# EAGLE design ProximitySensor (EAGLE 7.6.0)
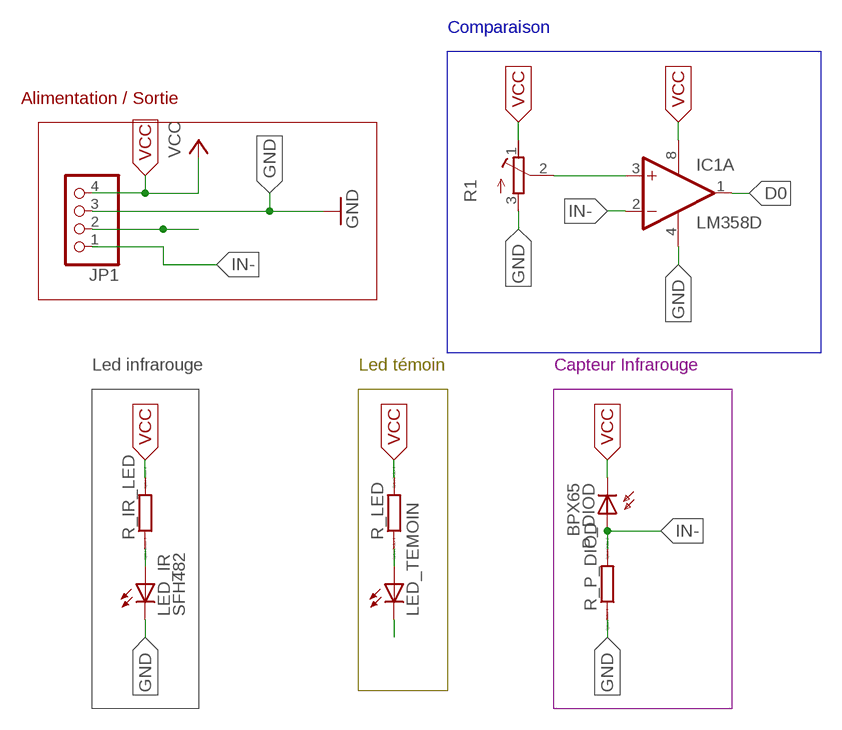
[diagram p0: schematic, sheet 1]

## Parts
IC1  LM358D  [SO08]
JP1  PINHD-1X4M  [1X04M]
LED_IR  SFH482  [SFH482]
LED_TEMOIN  LEDSMT1206  [1206]
P_DIOD  BPX65  [BPX65]
R1  R-TRIMMT93YA  [RTRIMT93YA]
R_IR_LED  RR1206  [R1206]
R_LED  RR1206  [R1206]
R_P_DIOD  RR1206  [R1206]

## Nets
D0: IC1.1(A:OUT) JP1.2 LED_TEMOIN.C
GND: IC1.4(P:V-) JP1.3 LED_IR.K(C) R1.3(A) R_P_DIOD.1
IN-: IC1.2(A:-IN) JP1.1 P_DIOD.A R_P_DIOD.2
N$1: LED_IR.A R_IR_LED.1
N$2: IC1.3(A:+IN) R1.2(S)
N$4: LED_TEMOIN.A R_LED.1
VCC: IC1.8(P:V+) JP1.4 P_DIOD.K(C) R1.1(E) R_IR_LED.2 R_LED.2
Unconnected: IC1.5(B:+IN) IC1.6(B:-IN) IC1.7(B:OUT)

## Buses
GND

## Notes on the sheet
- Comparaison
- Alimentation / Sortie
- Led infrarouge | Led témoin | Capteur Infrarouge

## Library data of the parts
IC1 = linear:LM358: OP AMP also LM158; LM258; LM2904 Source: http://cache.national.com/ds/LM/LM158.pdf
JP1 = pinhead:PINHD-1X4: PIN HEADER
LED_IR = led:SFH482: IR LED infrared emitting diode, Infineon
LED_TEMOIN = led:LED: LED OSRAM: - CHIPLED LG R971, LG N971, LY N971, LG Q971, LY Q971, LO R971, LY R971 LH N974, LH R974 LS Q976, LO Q976, LY Q976 LO Q996 - Hyper CHIPLED LW Q18S LB Q993, LB Q99A, LB R99A - SideLED LS A670, LO A670, LY A670, LG A670, LP A670 LB A673, LV A673, LT A673, LW A673 LH A674 LY A675 LS A676, LA A676, LO A676, LY A676, LW A676 LS A679, LY A679, LG A679 - Hyper Micro SIDELED® LS Y876, LA Y876, LO Y876, LY Y876 LT Y87S - SmartLED LW L88C, LW L88S LB L89C, LB L89S, LG L890 LS L89K, LO L89K, LY L89K LS L896, LA L896, LO L896, LY L896 - TOPLED LS T670, LO T670, LY T670, LG T670, LP T670 LSG T670, LSP T670, LSY T670, LOP T670, LYG T670 LG T671, LOG T671, LSG T671 LB T673, LV T673, LT T673, LW T673 LH T674 LS T676, LA T676, LO T676, LY T676, LB T676, LH T676, LSB T676, LW T676 LB T67C, LV T67C, LT T67C, LS T67K, LO T67K, LY T67K, LW E67C LS E67B, LA E67B, LO E67B, LY E67B, LB E67C, LV E67C, LT E67C LW T67C LS T679, LY T679, LG T679 LS T770, LO T770, LY T770, LG T770, LP T770 LB T773, LV T773, LT T773, LW T773 LH T774 LS E675, LA E675, LY E675, LS T675 LS T776, LA T776, LO T776, LY T776, LB T776 LHGB T686 LT T68C, LB T68C - Hyper Mini TOPLED® LB M676 - Mini TOPLED Santana® LG M470 LS M47K, LO M47K, LY M47K Source: http://www.osram.convergy.de LUXEON: - LUMILED® LXK2-PW12-R00, LXK2-PW12-S00, LXK2-PW14-U00, LXK2-PW14-V00 LXK2-PM12-R00, LXK2-PM12-S00, LXK2-PM14-U00 LXK2-PE12-Q00, LXK2-PE12-R00, LXK2-PE12-S00, LXK2-PE14-T00, LXK2-PE14-U00 LXK2-PB12-K00, LXK2-PB12-L00, LXK2-PB12-M00, LXK2-PB14-N00, LXK2-PB14-P00, LXK2-PB14-Q00 LXK2-PR12-L00, LXK2-PR12-M00, LXK2-PR14-Q00, LXK2-PR14-R00 LXK2-PD12-Q00, LXK2-PD12-R00, LXK2-PD12-S00 LXK2-PH12-R00, LXK2-PH12-S00 LXK2-PL12-P00, LXK2-PL12-Q00, LXK2-PL12-R00 Source: www.luxeon.com KINGBRIGHT: KA-3528ASYC Source: www.kingbright.com
P_DIOD = opto-trans-siemens:BPX65: PHOTO DIODE; MPN: BPX65.; OC_FARNELL: 327451; OC_NEWARK: 06WX2764
R1 = rcl:R-TRIMM: Trimm resistor
R_IR_LED R_LED R_P_DIOD = eagle-ltspice:R: RESISTOR, European symbol; SPICEMODEL: NONE; SPICEPREFIX: R

## Board
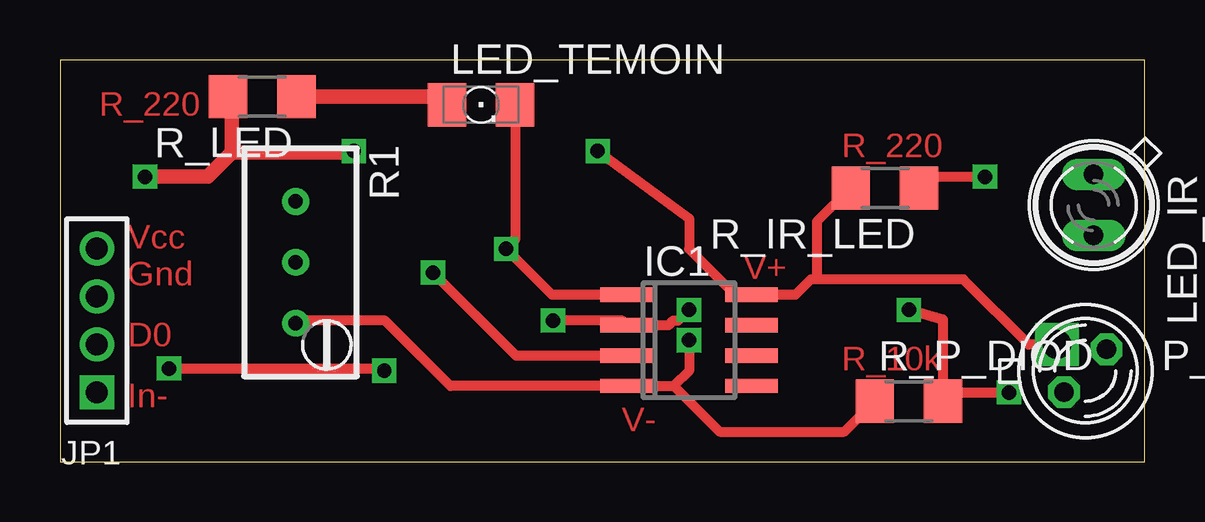
[diagram p1: board, top side]
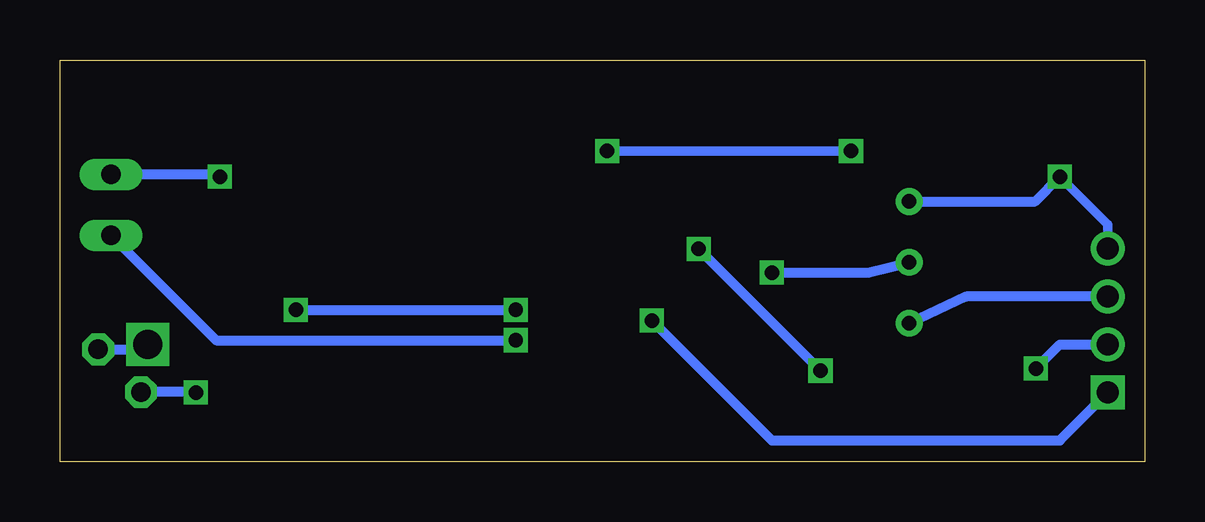
[diagram p2: board, bottom side, seen from below]

Size 45.2 x 16.77 mm. Coordinates in mm from the lower left corner, seen from the top.
Outline: 0,0 45.2,0 45.2,16.77 0,16.77 0,0
Copper layers (1*16): Top 0.035mm / dielectric 1.5mm / Bottom 0.035mm
Design rules "default": minimum track width 10mil, minimum drill 24mil, track to track 8mil, track to pad 8mil, pad to pad 8mil, via to via 8mil, smd to smd 8mil, copper to edge 40mil, drill to drill 8mil, minimum pad ring 10mil, minimum via ring 8mil, stop-mask expansion 4mil, vias tented up to drill 0mil, thermal gap 10mil

### Footprints (pad centres in the part's own frame; a part is rotated, then mirrored left to right if it is on the bottom)
SO08 = smd 0.6 x 2.2: 1 -1.905,-2.6; 2 -0.635,-2.6; 3 0.635,-2.6; 4 1.905,-2.6; 5 1.905,2.6; 6 0.635,2.6; 7 -0.635,2.6; 8 -1.905,2.6
1X04M = drill 0.914 square: 1 -3,0 | drill 0.914: 2 -1,0; 3 1,0; 4 3,0
SFH482 = drill 0.813 long: A -1.27,0; K 1.27,0
1206 = smd 1.6 x 1.803: A -1.422,0; C 1.422,0
BPX65 = drill 0.813 octagon: A -0.889,-0.889; K 0.889,0.889
RTRIMT93YA = drill 0.61: 1 0,-2.54; 2 0,0; 3 0,2.54
R1206 = smd 1.6 x 1.803: 1 -1.422,0; 2 1.422,0

### Placement (x,y rotation side)
IC1  26.21,5.08 270 top
JP1  1.54,5.9 90 top
LED_IR  43.07,10.72 270 top
LED_TEMOIN  17.54,14.9 0 top
P_DIOD  42.72,3.81 0 top
R1  9.82,8.33 180 top
R_IR_LED  34.37,11.43 180 top
R_LED  8.43,15.24 180 top
R_P_DIOD  35.37,2.54 0 top

### Tracks (layer width: path | path; a pad name or v marks a point on that pad's centre or on a via)
D0  (via drill 0.6)
  Top 0.406: IC1.1 20.49,6.98 v18.59,8.89 18.96,9.26 LED_TEMOIN.C | v4.54,3.9 13.42,3.9 v13.51,3.81
  Bottom 0.406: v18.59,8.89 v13.51,3.81 | v4.54,3.9 3.54,4.9 JP1.2
GND  (via drill 0.6)
  Top 0.406: 25.57,3.17 IC1.4 16.27,3.17 13.54,5.9 9.82,5.9 R1.3 | 25.57,3.17 27.48,1.27 32.68,1.27 R_P_DIOD.1 | v26.21,5.08 26.21,3.81 25.57,3.17
  Bottom 0.406: v26.21,5.08 38.7,5.08 LED_IR.K | JP1.3 7.44,6.9 R1.3
IN-  (via drill 0.6)
  Top 0.406: v35.37,6.35 36.79,5.93 R_P_DIOD.2 37.15,2.9 v39.54,2.9 | v20.54,5.9 23.43,5.9 IC1.2 25.36,5.71 25.54,5.9 25.76,5.9 v26.21,6.35
  Bottom 0.406: v35.37,6.35 v26.21,6.35 | v39.54,2.9 39.56,2.92 P_DIOD.A | v20.54,5.9 15.54,0.9 3.54,0.9 JP1.1
N$1  (via drill 0.6)
  Top 0.406: R_IR_LED.1 36.26,11.9 v38.54,11.9
  Bottom 0.406: v38.54,11.9 38.63,11.99 LED_IR.A
N$2  (via drill 0.6)
  Top 0.406: IC1.3 18.99,4.45 v15.54,7.9
  Bottom 0.406: v15.54,7.9 11.52,7.9 R1.2
N$3  (via drill 0.6)
  other vias: 26.21,5.08
N$4
  Top 0.406: 16.12,15.24 LED_TEMOIN.A
  Top 0.6: R_LED.1 16.12,15.24
VCC  (via drill 0.6, 1.2)
  Top 0.406: v22.4,12.97 26.21,10.16 26.21,8.89 28.11,6.98 IC1.8 30.65,6.98 31.29,7.62 31.54,7.62 | 31.54,7.62 37.64,7.62 40.36,4.9 v41.54,4.9 | 7.16,15.09 R_LED.2 | R_IR_LED.2 31.54,10.02 31.54,7.62 | v12.24,12.97 12.17,12.9
  Top 0.6: 7.16,12.9 7.16,15.09 | 7.16,12.9 6.16,11.9 v3.54,11.9 | 12.17,12.9 7.16,12.9
  Bottom 0.4: v12.24,12.97 v22.4,12.97 | v3.54,11.9 1.54,9.9 JP1.4
  Bottom 0.406: P_DIOD.K 41.74,4.7 v41.54,4.9 | R1.1 4.57,10.87 v3.54,11.9

### Text on the board
Top: R_220 | R_220 | Vcc | V+ | Gnd | D0 | R_10k | In- | V-